# Altium schematic sheet PART-02-抢答者指示电路图R100-149.SchDoc
size A4
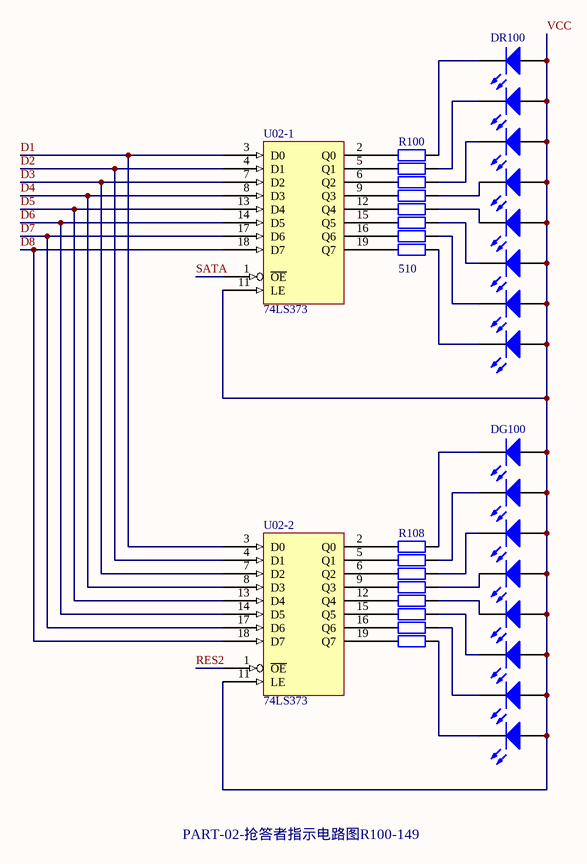
[diagram p0: PART-02-抢答者指示电路图R100-149.SchDoc]

## Parts
DG100  LED  [LED-0]  (value not drawn)
DG101  LED  [LED-0]  (value not drawn)
DG102  LED  [LED-0]  (value not drawn)
DG103  LED  [LED-0]  (value not drawn)
DG104  LED  [LED-0]  (value not drawn)
DG105  LED  [LED-0]  (value not drawn)
DG106  LED  [LED-0]  (value not drawn)
DG107  LED  [LED-0]  (value not drawn)
DR100  LED  [LED-0]  (value not drawn)
DR101  LED  [LED-0]  (value not drawn)
DR102  LED  [LED-0]  (value not drawn)
DR103  LED  [LED-0]  (value not drawn)
DR104  LED  [LED-0]  (value not drawn)
DR105  LED  [LED-0]  (value not drawn)
DR106  LED  [LED-0]  (value not drawn)
DR107  LED  [LED-0]  (value not drawn)
R100  value 510  [AXIAL-0.4]  (hidden comment: Res2)
R101  Res2  [AXIAL-0.4]  (value not drawn)
R102  Res2  [AXIAL-0.4]  (value not drawn)
R103  Res2  [AXIAL-0.4]  (value not drawn)
R104  Res2  [AXIAL-0.4]  (value not drawn)
R105  Res2  [AXIAL-0.4]  (value not drawn)
R106  Res2  [AXIAL-0.4]  (value not drawn)
R107  Res2  [AXIAL-0.4]  (value not drawn)
R108  Res2  [AXIAL-0.4]  (value not drawn)
R109  Res2  [AXIAL-0.4]  (value not drawn)
R110  Res2  [AXIAL-0.4]  (value not drawn)
R111  Res2  [AXIAL-0.4]  (value not drawn)
R112  Res2  [AXIAL-0.4]  (value not drawn)
R113  Res2  [AXIAL-0.4]  (value not drawn)
R114  Res2  [AXIAL-0.4]  (value not drawn)
R115  Res2  [AXIAL-0.4]  (value not drawn)
U02-1  74LS373  [DIP-20]
U02-2  74LS373  [DIP-20]

## Nets
GND: U02-1.10(GND) U02-2.10(GND)
VCC: DG100.1(A) DG101.1(A) DG102.1(A) DG103.1(A) DG104.1(A) DG105.1(A) DG106.1(A) DG107.1(A) DR100.1(A) DR101.1(A) DR102.1(A) DR103.1(A) DR104.1(A) DR105.1(A) DR106.1(A) DR107.1(A) U02-1.11(LE) U02-1.20(VCC) U02-2.11(LE) U02-2.20(VCC)
D1: U02-1.3(D0) U02-2.3(D0)
D2: U02-1.4(D1) U02-2.4(D1)
D3: U02-1.7(D2) U02-2.7(D2)
D4: U02-1.8(D3) U02-2.8(D3)
D5: U02-1.13(D4) U02-2.13(D4)
D6: U02-1.14(D5) U02-2.14(D5)
D7: U02-1.17(D6) U02-2.17(D6)
D8: U02-1.18(D7) U02-2.18(D7)
RES2: U02-2.1(~{OE})
SATA: U02-1.1(~{OE})
NetDG100_2: DG100.2(K) R108.2
NetDG101_2: DG101.2(K) R109.2
NetDG102_2: DG102.2(K) R110.2
NetDG103_2: DG103.2(K) R111.2
NetDG104_2: DG104.2(K) R112.2
NetDG105_2: DG105.2(K) R113.2
NetDG106_2: DG106.2(K) R114.2
NetDG107_2: DG107.2(K) R115.2
NetDR100_2: DR100.2(K) R100.2
NetDR101_2: DR101.2(K) R101.2
NetDR102_2: DR102.2(K) R102.2
NetDR103_2: DR103.2(K) R103.2
NetDR104_2: DR104.2(K) R104.2
NetDR105_2: DR105.2(K) R105.2
NetDR106_2: DR106.2(K) R106.2
NetDR107_2: DR107.2(K) R107.2
NetR100_1: R100.1 U02-1.2(Q0)
NetR101_1: R101.1 U02-1.5(Q1)
NetR102_1: R102.1 U02-1.6(Q2)
NetR103_1: R103.1 U02-1.9(Q3)
NetR104_1: R104.1 U02-1.12(Q4)
NetR105_1: R105.1 U02-1.15(Q5)
NetR106_1: R106.1 U02-1.16(Q6)
NetR107_1: R107.1 U02-1.19(Q7)
NetR108_1: R108.1 U02-2.2(Q0)
NetR109_1: R109.1 U02-2.5(Q1)
NetR110_1: R110.1 U02-2.6(Q2)
NetR111_1: R111.1 U02-2.9(Q3)
NetR112_1: R112.1 U02-2.12(Q4)
NetR113_1: R113.1 U02-2.15(Q5)
NetR114_1: R114.1 U02-2.16(Q6)
NetR115_1: R115.1 U02-2.19(Q7)

## Notes on the sheet
- PART-02-抢答者指示电路图R100-149

## Library data of the parts
DG100-DG107 DR100-DR107 = LED0: Typical INFRARED GaAs LED; Published: 8-Jun-2000; LatestRevisionDate: 08-Jul-2005; LatestRevisionNote: Mech Layer 1 removed.; PackageReference: LED-0; Publisher: Altium Limited
R100 = Res2: Resistor; Published: 8-Jun-2000; LatestRevisionDate: 17-Jul-2002; LatestRevisionNote: Re-released for DXP Platform.; PackageReference: AXIAL-0.4; Publisher: Altium Limited
R101-R115 = Res2: Resistor; Value: 510; Published: 8-Jun-2000; LatestRevisionDate: 17-Jul-2002; LatestRevisionNote: Re-released for DXP Platform.; PackageReference: AXIAL-0.4; Publisher: Altium Limited